# EAGLE schematic iv17-display-shield (EAGLE 7.5.0)

## Sheet 1 of 2
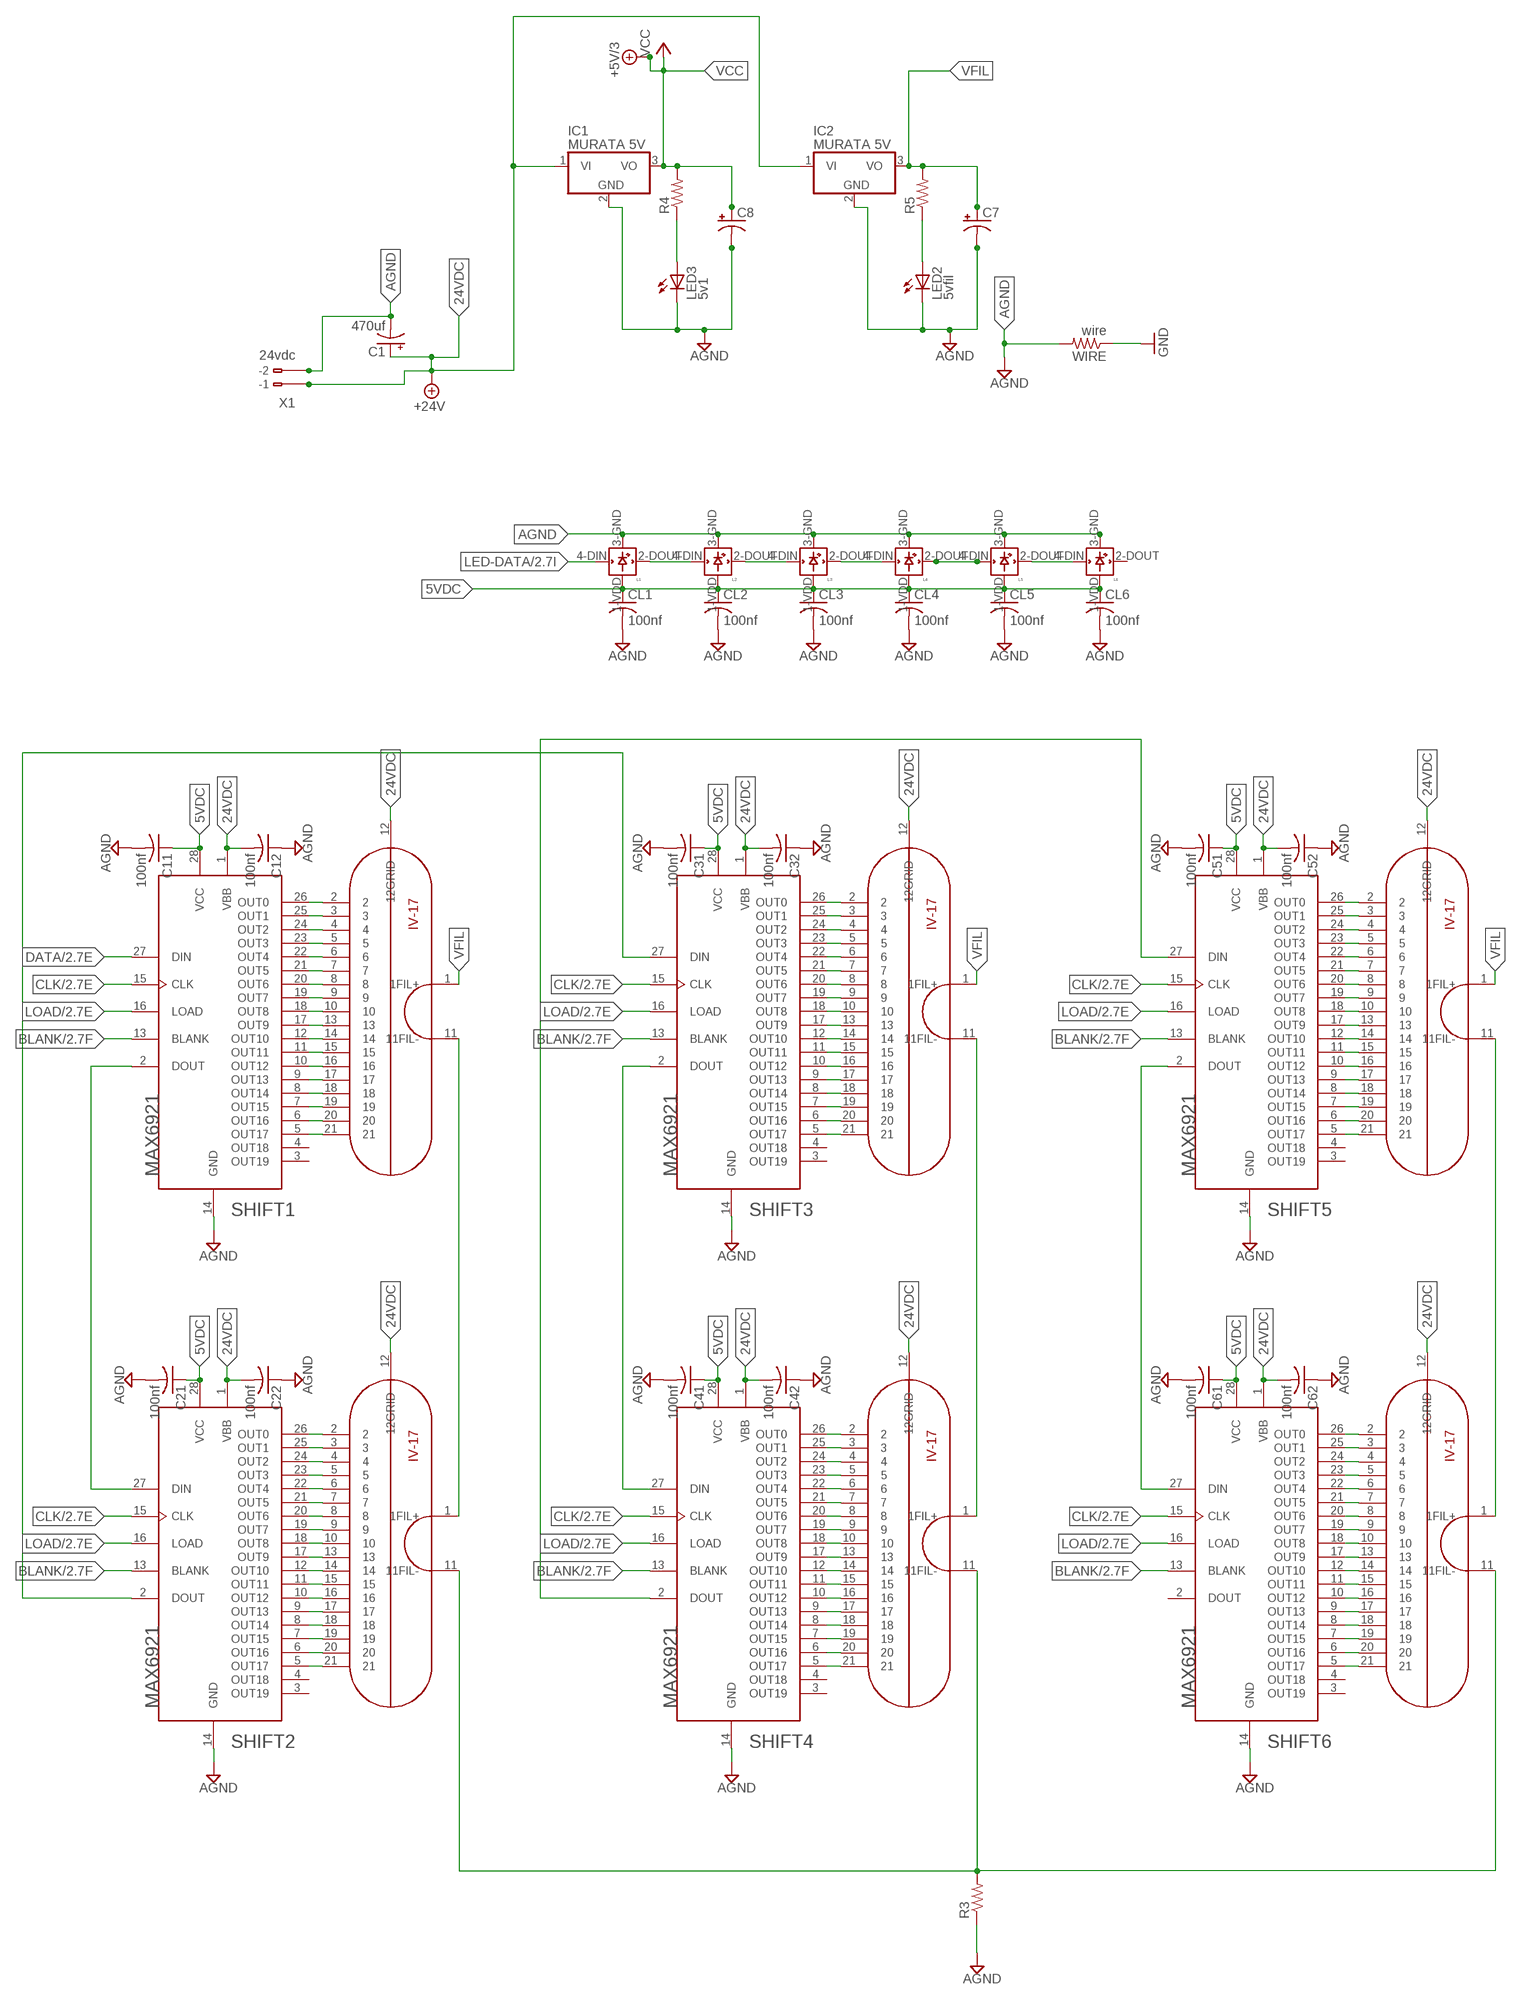
[diagram p0: schematic, sheet 1]

### Parts
C1  470uf  CPOL-USE5-10.5  [E5-10,5]
C7  CPOL-USE5-13  [E5-13]
C8  CPOL-USE5-13  [E5-13]
C11  100nf  C-USC1206  [C1206]
C12  100nf  C-USC1206  [C1206]
C21  100nf  C-USC1206  [C1206]
C22  100nf  C-USC1206  [C1206]
C31  100nf  C-USC1206  [C1206]
C32  100nf  C-USC1206  [C1206]
C41  100nf  C-USC1206  [C1206]
C42  100nf  C-USC1206  [C1206]
C51  100nf  C-USC1206  [C1206]
C52  100nf  C-USC1206  [C1206]
C61  100nf  C-USC1206  [C1206]
C62  100nf  C-USC1206  [C1206]
CL1  100nf  C-USC1206  [C1206]
CL2  100nf  C-USC1206  [C1206]
CL3  100nf  C-USC1206  [C1206]
CL4  100nf  C-USC1206  [C1206]
CL5  100nf  C-USC1206  [C1206]
CL6  100nf  C-USC1206  [C1206]
IC1  MURATA 5V  786TV  [TO220V]
IC2  MURATA 5V  786TV  [TO220V]
L1  WS2812B  [WS2812B]
L2  WS2812B  [WS2812B]
L3  WS2812B  [WS2812B]
L4  WS2812B  [WS2812B]
L5  WS2812B  [WS2812B]
L6  WS2812B  [WS2812B]
LED2  5vfil  TLLR4400  [LED3MM]
LED3  5v1  TLLR4400  [LED3MM]
R3  R-US_0309/12  [0309/12]
R4  R-US_M1206  [M1206]
R5  R-US_M1206  [M1206]
SHIFT1  MAX6921  [SOIC-28W]
SHIFT2  MAX6921  [SOIC-28W]
SHIFT3  MAX6921  [SOIC-28W]
SHIFT4  MAX6921  [SOIC-28W]
SHIFT5  MAX6921  [SOIC-28W]
SHIFT6  MAX6921  [SOIC-28W]
TUBE1  IV17  [NIXIE-22]
TUBE2  IV17  [NIXIE-22]
TUBE3  IV17  [NIXIE-22]
TUBE4  IV17  [NIXIE-22]
TUBE5  IV17  [NIXIE-22]
TUBE6  IV17  [NIXIE-22]
WIRE  wire  R-US_0309/12  [0309/12]
X1  24vdc  233-102  [233-102]

### Nets
5VDC: C11.1 C21.1 C31.1 C41.1 C51.1 C61.1 CL1.1 CL2.1 CL3.1 CL4.1 CL5.1 CL6.1 L1.1-VDD(VDD) L2.1-VDD(VDD) L3.1-VDD(VDD) L4.1-VDD(VDD) L5.1-VDD(VDD) L6.1-VDD(VDD) SHIFT1.28(VCC) SHIFT2.28(VCC) SHIFT3.28(VCC) SHIFT4.28(VCC) SHIFT5.28(VCC) SHIFT6.28(VCC)
24VDC: C1.+ C12.2 C22.2 C32.2 C42.2 C52.2 C62.2 IC1.1(VI) IC2.1(VI) SHIFT1.1(VBB) SHIFT2.1(VBB) SHIFT3.1(VBB) SHIFT4.1(VBB) SHIFT5.1(VBB) SHIFT6.1(VBB) TUBE1.12(12GRID) TUBE2.12(12GRID) TUBE3.12(12GRID) TUBE4.12(12GRID) TUBE5.12(12GRID) TUBE6.12(12GRID) X1.B1(B-1) ; supply symbol labelled +24V
AGND: C1.- C7.- C8.- C11.2 C12.1 C21.2 C22.1 C31.2 C32.1 C41.2 C42.1 C51.2 C52.1 C61.2 C62.1 CL1.2 CL2.2 CL3.2 CL4.2 CL5.2 CL6.2 IC1.2(GND) IC2.2(GND) L1.3-GND(GND) L2.3-GND(GND) L3.3-GND(GND) L4.3-GND(GND) L5.3-GND(GND) L6.3-GND(GND) LED2.K(C) LED3.K(C) R3.1 SHIFT1.14(GND) SHIFT2.14(GND) SHIFT3.14(GND) SHIFT4.14(GND) SHIFT5.14(GND) SHIFT6.14(GND) WIRE.2 X1.B2(B-2)
BLANK: SHIFT1.13(BLANK) SHIFT2.13(BLANK) SHIFT3.13(BLANK) SHIFT4.13(BLANK) SHIFT5.13(BLANK) SHIFT6.13(BLANK) ; also sheet 2
CLK: SHIFT1.15(CLK) SHIFT2.15(CLK) SHIFT3.15(CLK) SHIFT4.15(CLK) SHIFT5.15(CLK) SHIFT6.15(CLK) ; also sheet 2
DATA: SHIFT1.27(DIN) ; also sheet 2
GND: WIRE.1 ; also sheet 2
LED-DATA: L1.4-DIN(DIN) ; also sheet 2
LOAD: SHIFT1.16(LOAD) SHIFT2.16(LOAD) SHIFT3.16(LOAD) SHIFT4.16(LOAD) SHIFT5.16(LOAD) SHIFT6.16(LOAD) ; also sheet 2
N$1: SHIFT1.2(DOUT) SHIFT2.27(DIN)
N$2: TUBE5.11(11FIL-) TUBE6.1(1FIL+)
N$3: SHIFT2.2(DOUT) SHIFT3.27(DIN)
N$4: SHIFT3.2(DOUT) SHIFT4.27(DIN)
N$5: SHIFT4.2(DOUT) SHIFT5.27(DIN)
N$6: SHIFT5.2(DOUT) SHIFT6.27(DIN)
N$12: R3.2 TUBE2.11(11FIL-) TUBE4.11(11FIL-) TUBE6.11(11FIL-)
N$15: LED2.A R5.1
N$16: LED3.A R4.1
N$76: SHIFT5.26(OUT0) TUBE5.2
N$77: SHIFT5.25(OUT1) TUBE5.3
N$78: SHIFT5.24(OUT2) TUBE5.4
N$79: SHIFT5.23(OUT3) TUBE5.5
N$80: SHIFT5.22(OUT4) TUBE5.6
N$81: SHIFT5.21(OUT5) TUBE5.7
N$82: SHIFT5.20(OUT6) TUBE5.8
N$83: SHIFT5.19(OUT7) TUBE5.9
N$84: SHIFT5.18(OUT8) TUBE5.10
N$86: SHIFT5.17(OUT9) TUBE5.13
N$87: SHIFT5.12(OUT10) TUBE5.14
N$88: SHIFT5.11(OUT11) TUBE5.15
N$89: SHIFT5.10(OUT12) TUBE5.16
N$90: SHIFT5.9(OUT13) TUBE5.17
N$91: SHIFT5.8(OUT14) TUBE5.18
N$92: SHIFT5.7(OUT15) TUBE5.19
N$93: SHIFT5.6(OUT16) TUBE5.20
N$94: SHIFT5.5(OUT17) TUBE5.21
N$95: SHIFT6.26(OUT0) TUBE6.2
N$96: SHIFT6.25(OUT1) TUBE6.3
N$97: SHIFT6.24(OUT2) TUBE6.4
N$98: SHIFT6.23(OUT3) TUBE6.5
N$99: SHIFT6.22(OUT4) TUBE6.6
N$100: SHIFT6.21(OUT5) TUBE6.7
N$101: SHIFT6.20(OUT6) TUBE6.8
N$102: SHIFT6.19(OUT7) TUBE6.9
N$103: SHIFT6.18(OUT8) TUBE6.10
N$104: SHIFT6.17(OUT9) TUBE6.13
N$105: SHIFT6.12(OUT10) TUBE6.14
N$106: SHIFT6.11(OUT11) TUBE6.15
N$108: SHIFT6.10(OUT12) TUBE6.16
N$115: SHIFT6.9(OUT13) TUBE6.17
N$116: SHIFT6.8(OUT14) TUBE6.18
N$117: SHIFT6.7(OUT15) TUBE6.19
N$118: SHIFT6.6(OUT16) TUBE6.20
N$119: SHIFT6.5(OUT17) TUBE6.21
N$120: SHIFT3.26(OUT0) TUBE3.2
N$121: SHIFT3.25(OUT1) TUBE3.3
N$122: SHIFT3.24(OUT2) TUBE3.4
N$123: SHIFT3.23(OUT3) TUBE3.5
N$124: SHIFT3.22(OUT4) TUBE3.6
N$125: SHIFT3.21(OUT5) TUBE3.7
N$126: SHIFT3.20(OUT6) TUBE3.8
N$127: SHIFT3.19(OUT7) TUBE3.9
N$128: SHIFT3.18(OUT8) TUBE3.10
N$129: SHIFT3.17(OUT9) TUBE3.13
N$130: SHIFT3.12(OUT10) TUBE3.14
N$131: SHIFT3.11(OUT11) TUBE3.15
N$132: SHIFT3.10(OUT12) TUBE3.16
N$134: SHIFT3.9(OUT13) TUBE3.17
N$136: SHIFT3.8(OUT14) TUBE3.18
N$137: SHIFT3.7(OUT15) TUBE3.19
N$138: SHIFT3.6(OUT16) TUBE3.20
N$139: SHIFT3.5(OUT17) TUBE3.21
N$140: SHIFT4.26(OUT0) TUBE4.2
N$141: SHIFT4.25(OUT1) TUBE4.3
N$142: SHIFT4.24(OUT2) TUBE4.4
N$143: SHIFT4.23(OUT3) TUBE4.5
N$144: SHIFT4.22(OUT4) TUBE4.6
N$145: SHIFT4.21(OUT5) TUBE4.7
N$146: SHIFT4.20(OUT6) TUBE4.8
N$147: SHIFT4.19(OUT7) TUBE4.9
N$148: SHIFT4.18(OUT8) TUBE4.10
N$149: SHIFT4.17(OUT9) TUBE4.13
N$150: SHIFT4.12(OUT10) TUBE4.14
N$151: SHIFT4.11(OUT11) TUBE4.15
N$152: SHIFT4.10(OUT12) TUBE4.16
N$153: SHIFT4.9(OUT13) TUBE4.17
N$154: SHIFT4.8(OUT14) TUBE4.18
N$156: SHIFT4.7(OUT15) TUBE4.19
N$158: L1.2-DOUT(DOUT) L2.4-DIN(DIN)
N$159: SHIFT4.6(OUT16) TUBE4.20
N$160: SHIFT4.5(OUT17) TUBE4.21
N$161: SHIFT1.26(OUT0) TUBE1.2
N$162: SHIFT1.25(OUT1) TUBE1.3
N$163: SHIFT1.24(OUT2) TUBE1.4
N$164: SHIFT1.23(OUT3) TUBE1.5
N$165: SHIFT1.22(OUT4) TUBE1.6
N$166: SHIFT1.21(OUT5) TUBE1.7
N$167: SHIFT1.20(OUT6) TUBE1.8
N$168: SHIFT1.19(OUT7) TUBE1.9
N$169: SHIFT1.18(OUT8) TUBE1.10
N$170: SHIFT1.17(OUT9) TUBE1.13
N$171: SHIFT1.12(OUT10) TUBE1.14
N$172: SHIFT1.11(OUT11) TUBE1.15
N$173: SHIFT1.10(OUT12) TUBE1.16
N$174: SHIFT1.9(OUT13) TUBE1.17
N$175: SHIFT1.8(OUT14) TUBE1.18
N$176: SHIFT1.7(OUT15) TUBE1.19
N$178: SHIFT1.6(OUT16) TUBE1.20
N$179: L2.2-DOUT(DOUT) L3.4-DIN(DIN)
N$180: L3.2-DOUT(DOUT) L4.4-DIN(DIN)
N$181: SHIFT1.5(OUT17) TUBE1.21
N$182: SHIFT2.26(OUT0) TUBE2.2
N$183: SHIFT2.25(OUT1) TUBE2.3
N$184: SHIFT2.24(OUT2) TUBE2.4
N$185: SHIFT2.23(OUT3) TUBE2.5
N$186: SHIFT2.22(OUT4) TUBE2.6
N$187: SHIFT2.21(OUT5) TUBE2.7
N$188: SHIFT2.20(OUT6) TUBE2.8
N$189: SHIFT2.19(OUT7) TUBE2.9
N$190: SHIFT2.18(OUT8) TUBE2.10
N$191: SHIFT2.17(OUT9) TUBE2.13
N$192: SHIFT2.12(OUT10) TUBE2.14
N$193: SHIFT2.11(OUT11) TUBE2.15
N$194: SHIFT2.10(OUT12) TUBE2.16
N$195: SHIFT2.9(OUT13) TUBE2.17
N$196: SHIFT2.8(OUT14) TUBE2.18
N$197: SHIFT2.7(OUT15) TUBE2.19
N$198: SHIFT2.6(OUT16) TUBE2.20
N$200: SHIFT2.5(OUT17) TUBE2.21
N$201: L4.2-DOUT(DOUT) L5.4-DIN(DIN)
N$202: L5.2-DOUT(DOUT) L6.4-DIN(DIN)
N$225: TUBE1.11(11FIL-) TUBE2.1(1FIL+)
N$227: TUBE3.11(11FIL-) TUBE4.1(1FIL+)
VCC: C8.+ IC1.3(VO) R4.2 ; supply symbol labelled +5V/3 ; also sheet 2
VFIL: C7.+ IC2.3(VO) R5.2 TUBE1.1(1FIL+) TUBE3.1(1FIL+) TUBE5.1(1FIL+)
Unconnected: L6.2-DOUT(DOUT) SHIFT1.3(OUT19) SHIFT1.4(OUT18) SHIFT2.3(OUT19) SHIFT2.4(OUT18) SHIFT3.3(OUT19) SHIFT3.4(OUT18) SHIFT4.3(OUT19) SHIFT4.4(OUT18) SHIFT5.3(OUT19) SHIFT5.4(OUT18) SHIFT6.2(DOUT) SHIFT6.3(OUT19) SHIFT6.4(OUT18) X1.A1(-1) X1.A2(-2)

## Sheet 2 of 2
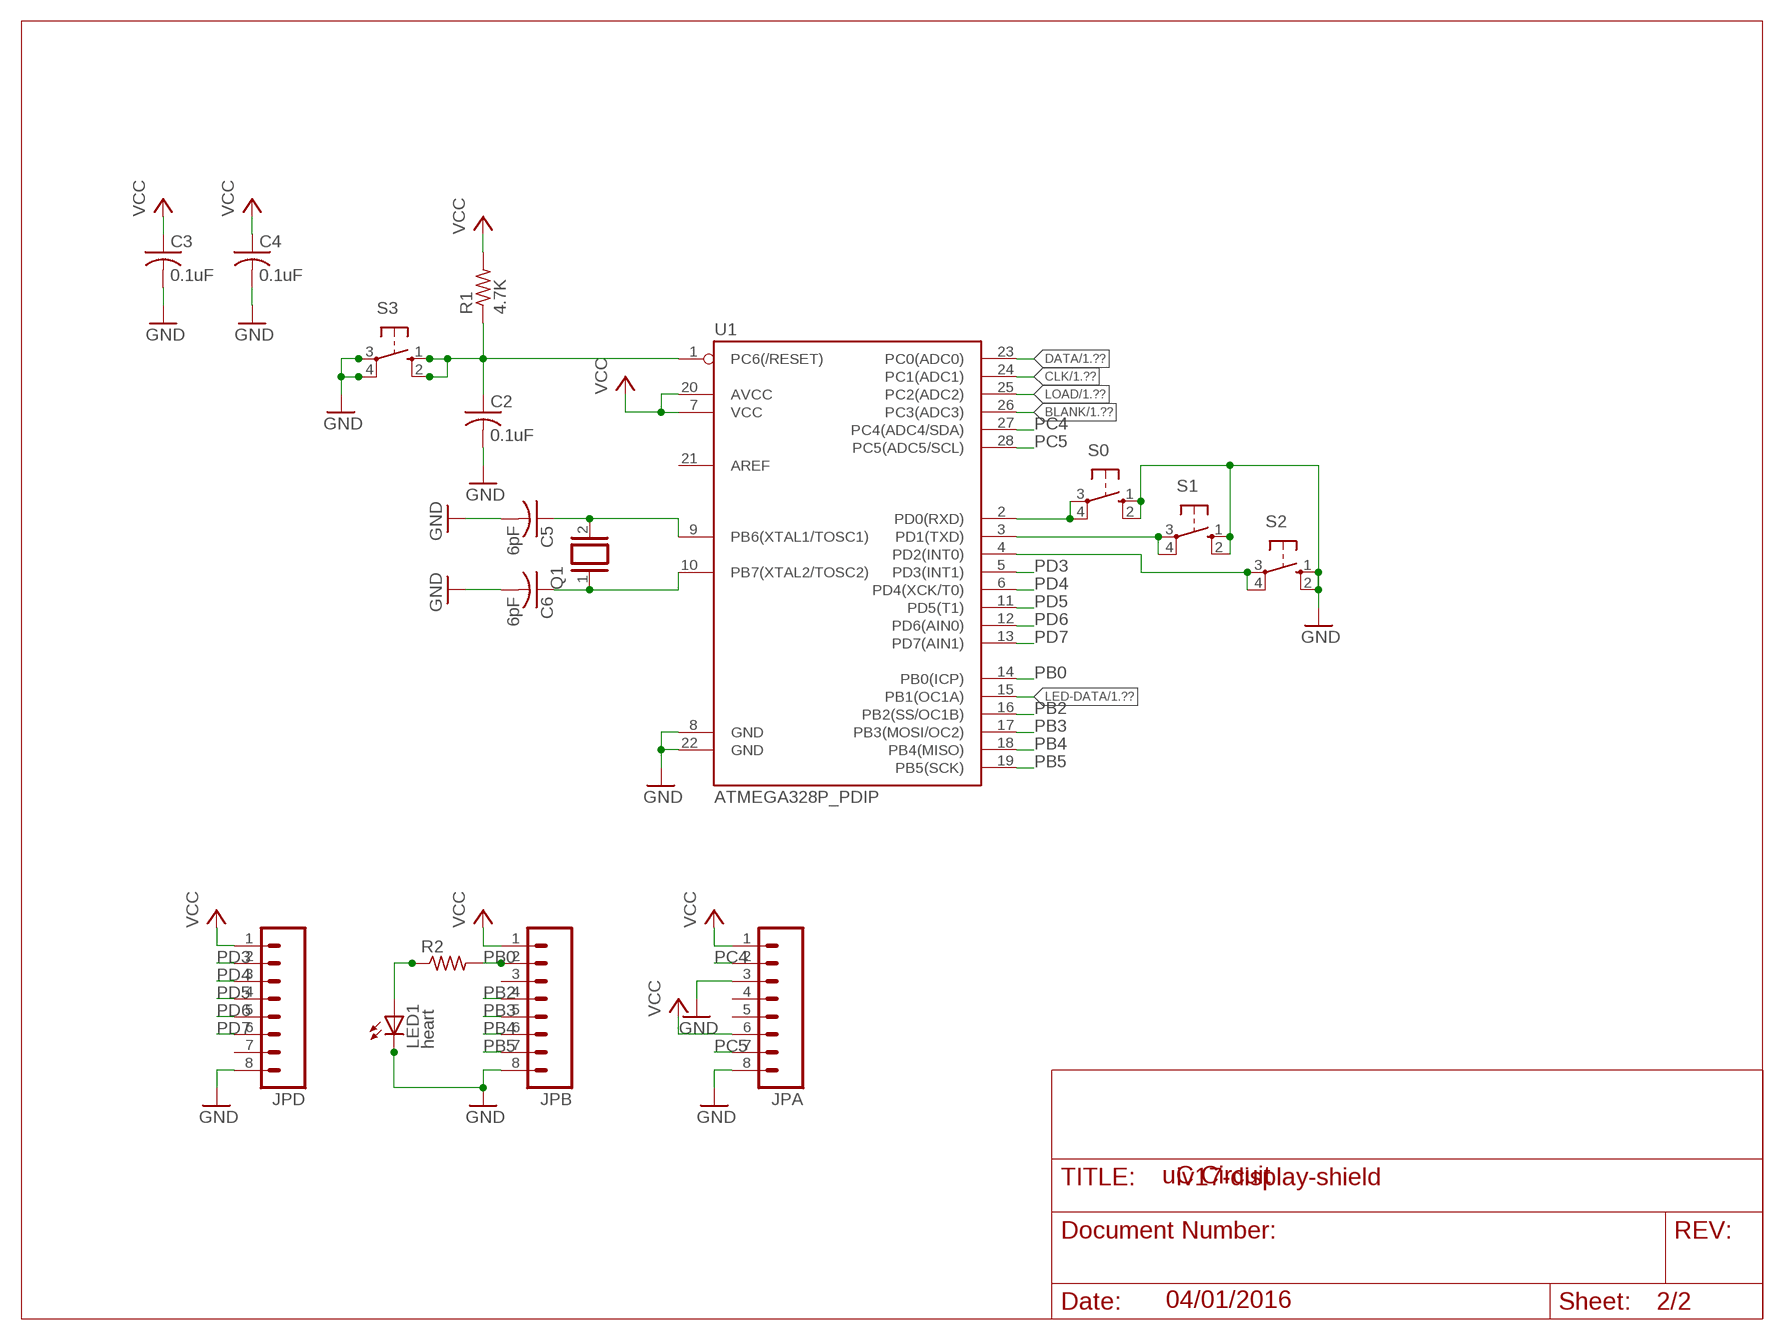
[diagram p1: schematic, sheet 2]
MICRO (LETTER_L): DATE: 04/01/2016; TITLE: uC Circuit

### Parts
C2  0.1uF  C-USC1206  [C1206]
C3  0.1uF  C-USC1206  [C1206]
C4  0.1uF  C-USC1206  [C1206]
C5  6pF  C-USC1206  [C1206]
C6  6pF  C-USC1206  [C1206]
JPA  M08  [1X08_ROUND]
JPB  M08  [1X08_ROUND]
JPD  M08  [1X08_ROUND]
LED1  heart  TLLG4400  [LED3MM]
Q1  XTAL/S  [QS]
R1  4.7K  R-US_0309/12  [0309/12]
R2  R-US_M1206  [M1206]
S0  40-XX  [B3F-40XX]
S1  40-XX  [B3F-40XX]
S2  40-XX  [B3F-40XX]
S3  10-XX  [B3F-10XX]
U1  ATMEGA328P_PDIP  [DIL28-3]

### Nets
BLANK: U1.26(PC3(ADC3)) ; also sheet 1
CLK: U1.24(PC1(ADC1)) ; also sheet 1
DATA: U1.23(PC0(ADC0)) ; also sheet 1
GND: C2.2 C3.2 C4.2 C5.2 C6.2 JPA.3 JPA.8 JPB.8 JPD.8 LED1.K(C) S0.1(S) S0.2(S1) S1.1(S) S1.2(S1) S2.1(S) S2.2(S1) S3.3(P) S3.4(P1) U1.8(GND) U1.22(GND) ; also sheet 1
LED-DATA: U1.15(PB1(OC1A)) ; also sheet 1
LOAD: U1.25(PC2(ADC2)) ; also sheet 1
N$7: C2.1 R1.1 S3.1(S) S3.2(S1) U1.1(PC6(/RESET))
N$8: S0.3(P) S0.4(P1) U1.2(PD0(RXD))
N$9: C5.1 Q1.2 U1.9(PB6(XTAL1/TOSC1))
N$10: S1.3(P) S1.4(P1) U1.3(PD1(TXD))
N$11: S2.3(P) S2.4(P1) U1.4(PD2(INT0))
N$13: C6.1 Q1.1 U1.10(PB7(XTAL2/TOSC2))
N$14: LED1.A R2.1
PB0: JPB.2 R2.2 U1.14(PB0(ICP))
PB2: JPB.4 U1.16(PB2(SS/OC1B))
PB3: JPB.5 U1.17(PB3(MOSI/OC2))
PB4: JPB.6 U1.18(PB4(MISO))
PB5: JPB.7 U1.19(PB5(SCK))
PC4: JPA.2 U1.27(PC4(ADC4/SDA))
PC5: JPA.7 U1.28(PC5(ADC5/SCL))
PD3: JPD.2 U1.5(PD3(INT1))
PD4: JPD.3 U1.6(PD4(XCK/T0))
PD5: JPD.4 U1.11(PD5(T1))
PD6: JPD.5 U1.12(PD6(AIN0))
PD7: JPD.6 U1.13(PD7(AIN1))
VCC: C3.1 C4.1 JPA.1 JPA.6 JPB.1 JPD.1 R1.2 U1.7(VCC) U1.20(AVCC) ; also sheet 1
Unconnected: JPA.4 JPA.5 JPB.3 JPD.7 U1.21(AREF)

## Library data of the parts
C1 C7 C8 = rcl:CPOL-US: POLARIZED CAPACITOR, American symbol
C2-C6 C11 C12 C21 C22 C31 C32 C41 C42 C51 C52 C61 C62 CL1-CL6 = rcl:C-US: CAPACITOR, American symbol
IC1 IC2 = linear:78*: Positive VOLTAGE REGULATOR Source: http://cache.national.com/ds/LM/LM78L05.pdf http://www.fairchildsemi.com/ds/LM/LM7805.pdf
JPA JPB JPD = SparkFun-Connectors:M08: Header 8 Standard 8-pin 0.1" header. Use with straight break away headers (SKU : PRT-00116), right angle break away headers (PRT-00553), swiss pins (PRT-00743), machine pins (PRT-00117), and female headers (PRT-00115).
L1-L6 = adafruit:WS2812B
LED1 = led:TLLG4400: Low Current (2mA) LED 3 mm Tinted Diffused Package color GREEN Source: Data sheet <http://www.farnell.com/datasheets/391098.pdf>; MF: VISHAY SEMICONDUCTOR; OC_FARNELL: 1612435
LED2 LED3 = led:TLLR4400: Low Current (2mA) LED 3 mm Tinted Diffused Package color RED Source: Data sheet <http://www.farnell.com/datasheets/391100.pdf>; MF: VISHAY SEMICONDUCTOR; OC_FARNELL: 1612437
Q1 = special:XTAL/S: CRYSTAL
R1 R3 WIRE = rcl:R-US_: RESISTOR, American symbol
R2 R4 R5 = resistor:R-US_: RESISTOR, American symbol
S0 S1 S2 = switch-omron:40-XX: OMRON SWITCH; MF: OMRON COMPONENTS USA; MPN: B3F-4000; OC_FARNELL: 176434; OC_NEWARK: 36K3105
S3 = switch-omron:10-XX: OMRON SWITCH; MPN: B3F-1000; OC_FARNELL: 176432; OC_NEWARK: 36M3542
SHIFT1-SHIFT6 = adafruit:MAX6921: MAX6921 76V VFD driver in TSSOP and PLCC. Can be cascaded, talk to it via SPI
TUBE1-TUBE6 = XXXXXXtube supl:IV17
U1 = SparkFun-DigitalIC:ATMEGA328P_PDIP: uC used in the Arduino 32kb flash, 1k EEPROM, 2k SRAM This is the through-hole version of this chip.
X1 = con-wago:233-102: WAGO Cage Clamp; MPN: 233-102; OC_FARNELL: unknown; OC_NEWARK: 28K9044